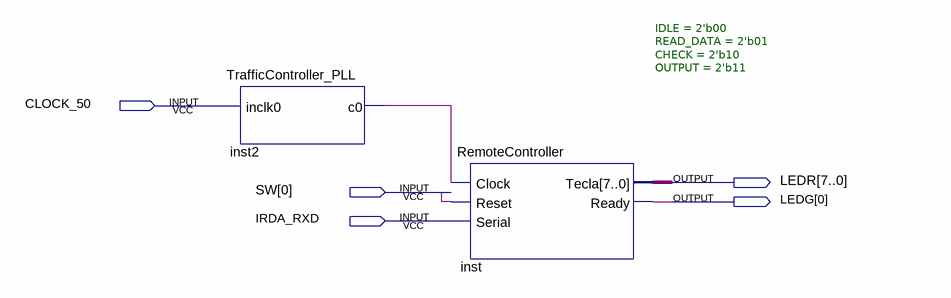
[diagram p0: schematic sheet]
// Quartus schematic questao1.bdf as structural Verilog: 2 symbols, 5 pins
module questao1 (
  input  CLOCK_50,
  input  [0:0] SW,
  input  IRDA_RXD,
  output [7:0] LEDR,
  output [0:0] LEDG
);

  wire inst2_c0;

  TrafficController_PLL inst2 (.inclk0(CLOCK_50), .c0(inst2_c0));
  RemoteController #(.IDLE(2'b00), .READ_DATA(2'b01), .CHECK(2'b10), .OUTPUT(2'b11)) inst (
    .Clock(inst2_c0), .Reset(SW[0]), .Serial(IRDA_RXD), .Tecla(LEDR), .Ready(LEDG[0]));
endmodule
